# Altium schematic sheet Modulo_Sensores.SchDoc
size A4; PageSetup: Record=PageOptions|CenterHorizontal=True|CenterVertical=True|PrintScale=1.00|XCorrection=1.00|YCorrection=1.00|PrintKind=1|BorderSize=5000000|LeftOffset=0|BottomOffset=0|Orientation=2|PaperLength=1000|PaperWidth=1000|Scale=100|PaperSource=7|PrintQuality=-4|MediaType=1|DitherType=10|PaperKind=A4 (210 x 297 mm)|PrintScaleMode=1
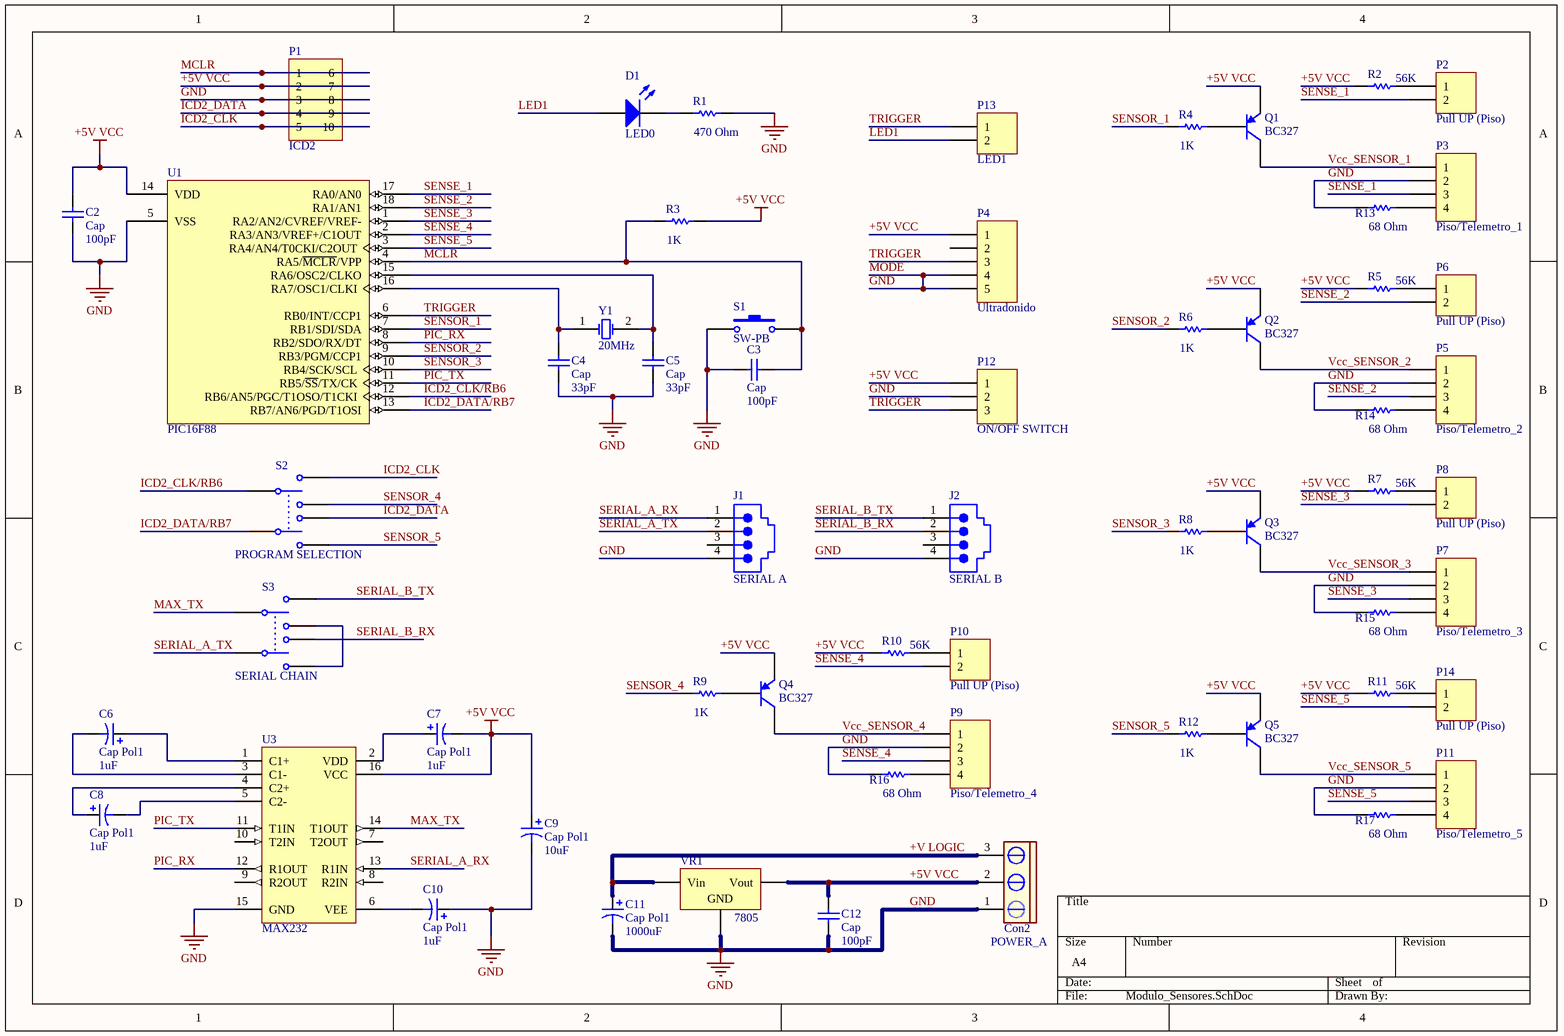
[diagram p0: Modulo_Sensores.SchDoc]

## Parts
C2  Cap  value 100pF  [CAPR2.54-5.1x3.2]
C3  Cap  value 100pF  [CAPR2.54-5.1x3.2]
C4  Cap  value 33pF  [CAPR2.54-5.1x3.2]
C5  Cap  value 33pF  [CAPR2.54-5.1x3.2]
C6  Cap Pol1  value 1uF  [CAPPR2-5x6.8]
C7  Cap Pol1  value 1uF  [CAPPR2-5x6.8]
C8  Cap Pol1  value 1uF  [CAPPR2-5x6.8]
C9  Cap Pol1  value 10uF  [CAPPR2-5x6.8]
C10  Cap Pol1  value 1uF  [CAPPR2-5x6.8]
C11  Cap Pol1  value 1000uF  [RB5-10.5]
C12  Cap  value 100pF  [CAPR2.54-5.1x3.2]
Con2  POWER_A  [My_CN3]
D1  LED0  [LED-0]
J1  SERIAL A  [15-43-6245]
J2  SERIAL B  [15-43-6245]
P1  ICD2  [HEADER10_5x2_B]
P2  Pull UP (Piso)  [HDR1X2]
P3  Piso/Telemetro_1  [HDR1X4]
P4  Ultradonido  [HDR1X5]
P5  Piso/Telemetro_2  [HDR1X4]
P6  Pull UP (Piso)  [HDR1X2]
P7  Piso/Telemetro_3  [HDR1X4]
P8  Pull UP (Piso)  [HDR1X2]
P9  Piso/Telemetro_4  [HDR1X4]
P10  Pull UP (Piso)  [HDR1X2]
P11  Piso/Telemetro_5  [HDR1X4]
P12  ON/OFF SWITCH  [HDR1X3]
P13  LED1  [HDR1X2]
P14  Pull UP (Piso)  [HDR1X2]
Q1  BC327  [TO-92A]
Q2  BC327  [TO-92A]
Q3  BC327  [TO-92A]
Q4  BC327  [TO-92A]
Q5  BC327  [TO-92A]
R1  value 470 Ohm  [AXIAL-0.3]  (hidden comment: Res1)
R2  value 56K  [AXIAL-0.3]  (hidden comment: Res1)
R3  value 1K  [AXIAL-0.3]  (hidden comment: Res1)
R4  value 1K  [AXIAL-0.3]  (hidden comment: Res1)
R5  value 56K  [AXIAL-0.3]  (hidden comment: Res1)
R6  value 1K  [AXIAL-0.3]  (hidden comment: Res1)
R7  value 56K  [AXIAL-0.3]  (hidden comment: Res1)
R8  value 1K  [AXIAL-0.3]  (hidden comment: Res1)
R9  value 1K  [AXIAL-0.3]  (hidden comment: Res1)
R10  value 56K  [AXIAL-0.3]  (hidden comment: Res1)
R11  value 56K  [AXIAL-0.3]  (hidden comment: Res1)
R12  value 1K  [AXIAL-0.3]  (hidden comment: Res1)
R13  value 68 Ohm  [AXIAL-0.3]  (hidden comment: Res1)
R14  value 68 Ohm  [AXIAL-0.3]  (hidden comment: Res1)
R15  value 68 Ohm  [AXIAL-0.3]  (hidden comment: Res1)
R16  value 68 Ohm  [AXIAL-0.3]  (hidden comment: Res1)
R17  value 68 Ohm  [AXIAL-0.3]  (hidden comment: Res1)
S1  SW-PB  [TS-063]
S2  PROGRAM SELECTION  [LD-202mini]
S3  SERIAL CHAIN  [LD-202mini]
U1  PIC16F88  [PDIP300-P18]
U3  MAX232  [PE16A]
VR1  7805  [My_TO-220]
Y1  20MHz  [My_Crystal]

## Nets
+5V VCC: C2.2 C7.2 C9.1 C12.2 Con2.2 P1.2 P1.7 P4.1 P12.1 Q1.1(E) Q2.1(E) Q3.1(E) Q4.1(E) Q5.1(E) R2.1 R3.2 R5.1 R7.1 R10.1 R11.1 U1.14(VDD) U3.16(VCC) VR1.3(Vout)
GND: C2.1 C3.1 C4.1 C5.1 C9.2 C10.1 C11.2 C12.1 Con2.1 J1.4 J2.4 P1.3 P1.8 P3.2 P4.4 P4.5 P5.2 P7.2 P9.2 P11.2 P12.2 R1.2 R13.1 R14.1 R15.1 R16.1 R17.1 S1.1 U1.5(VSS) U3.15(GND) VR1.2(GND)  [also labelled MODE]
+V LOGIC: C11.1 Con2.3 VR1.1(Vin)
ICD2_CLK: P1.5 P1.10 S2.2
ICD2_CLK/RB6: S2.1 U1.12(RB6/AN5/PGC/T1OSO/T1CKI)
ICD2_DATA: P1.4 P1.9 S2.5
ICD2_DATA/RB7: S2.4 U1.13(RB7/AN6/PGD/T1OSI)
LED1: D1.1(A) P13.2
MAX_TX: S3.1 U3.14(T1OUT)
MCLR: C3.2 P1.1 P1.6 R3.1 S1.2 U1.4(RA5/~{MCLR}/VPP)
PIC_RX: U1.8(RB2/SDO/RX/DT) U3.12(R1OUT)
PIC_TX: U1.11(RB5/~{SS}/TX/CK) U3.11(T1IN)
SENSE_1: P2.2 P3.3 U1.17(RA0/AN0)
SENSE_2: P5.3 P6.2 U1.18(RA1/AN1)
SENSE_3: P7.3 P8.2 U1.1(RA2/AN2/CVREF/VREF-)
SENSE_4: P9.3 P10.2 U1.2(RA3/AN3/VREF+/C1OUT)
SENSE_5: P11.3 P14.2 U1.3(RA4/AN4/T0CKI/C2OUT)
SENSOR_1: R4.1 U1.7(RB1/SDI/SDA)
SENSOR_2: R6.1 U1.9(RB3/PGM/CCP1)
SENSOR_3: R8.1 U1.10(RB4/SCK/SCL)
SENSOR_4: R9.1 S2.3
SENSOR_5: R12.1 S2.6
SERIAL_A_RX: J1.1 U3.13(R1IN)
SERIAL_A_TX: J1.2 S3.4
SERIAL_B_RX: J2.2 S3.5
SERIAL_B_TX: J2.1 S3.2
TRIGGER: P4.3 P12.3 P13.1 U1.6(RB0/INT/CCP1)
Vcc_SENSOR_1: P3.1 Q1.3(C)
Vcc_SENSOR_2: P5.1 Q2.3(C)
Vcc_SENSOR_3: P7.1 Q3.3(C)
Vcc_SENSOR_4: P9.1 Q4.3(C)
Vcc_SENSOR_5: P11.1 Q5.3(C)
NetC4_2: C4.2 U1.16(RA7/OSC1/CLKI) Y1.1(OSC1)
NetC5_2: C5.2 U1.15(RA6/OSC2/CLKO) Y1.2(OSC2)
NetC6_1: C6.1 U3.1(C1+)
NetC6_2: C6.2 U3.3(C1-)
NetC7_1: C7.1 U3.2(VDD)
NetC8_1: C8.1 U3.4(C2+)
NetC8_2: C8.2 U3.5(C2-)
NetC10_2: C10.2 U3.6(VEE)
NetD1_2: D1.2(K) R1.1
NetP2_1: P2.1 R2.2
NetP3_4: P3.4 R13.2
NetP5_4: P5.4 R14.2
NetP6_1: P6.1 R5.2
NetP7_4: P7.4 R15.2
NetP8_1: P8.1 R7.2
NetP9_4: P9.4 R16.2
NetP10_1: P10.1 R10.2
NetP11_4: P11.4 R17.2
NetP14_1: P14.1 R11.2
NetQ1_2: Q1.2(B) R4.2
NetQ2_2: Q2.2(B) R6.2
NetQ3_2: Q3.2(B) R8.2
NetQ4_2: Q4.2(B) R9.2
NetQ5_2: Q5.2(B) R12.2
NetS3_3: S3.3 S3.6

Not connected (* = marked no-connect by the designer): J1 3; J2 3; P4 2; U3 7(T2OUT) 8(R2IN) 9(R2OUT) 10(T2IN)

## Library data of the parts
C2-C5 C12 = Cap: Capacitor; Published: 8-Jun-2000; LatestRevisionDate: 17-Jul-2002; LatestRevisionNote: Re-released for DXP Platform.; PackageReference: RAD-0.3; Publisher: Altium Limited
C6-C11 = Cap Pol1: Polarized Capacitor (Radial); Published: 8-Jun-2000; LatestRevisionDate: 17-Jul-2002; LatestRevisionNote: Re-released for DXP Platform.; PackageReference: RB7.6-15; Publisher: Altium Limited
Con2 = CON3 pin Green: Connector green screw
D1 = LED0: Typical INFRARED GaAs LED; Published: 8-Jun-2000; LatestRevisionDate: 08-Jul-2005; LatestRevisionNote: Mech Layer 1 removed.; PackageReference: LED-0; Publisher: Altium Limited
J1 J2 = 15-43-6245: Right Angle, Standard Profile, RJ45-Keyed, Flange Mount PCB Jack; Ports: 1; Positions/Loaded: Port1 - 8 Keyed/4; PerformanceCategory: 3; PCB_Mounting: Thru-Hole; ComponentAvailability: Obsolete; DrillSize: Nominal, Rounded to nearest 0.05mm; PCB_Layout: Complies with Manufacturer's Recommendation.; Published: 25-Jun-2002; DatasheetDocument: 18-Dec-2001; PackageDocument: 18-Dec-2001; PackageReference: 15-43-6245; Publisher: Altium Limited; ComponentLink1Description: Manufacturer Link; ComponentLink1URL: http://www.molex.com/; ComponentLink2Description: Datasheet; ComponentLink2URL: http://www.molex.com/cmc_upload/common_files/1212003_catalogmx41314.pdf; ComponentLink3Description: Iges Model; ComponentLink3URL: http://www.molex.com/pdm_docs/igs/15-43-6233_igs.zip
P1 = Header 5X2A: Header, 5-Pin, Dual row; LatestRevisionDate: 17-Jul-2002; LatestRevisionNote: Re-released for DXP Platform.; Publisher: Altium Limited
P2 P6 P8 P10 P13 P14 = Header 2: Header, 2-Pin; LatestRevisionDate: 17-Jul-2002; LatestRevisionNote: Re-released for DXP Platform.; Publisher: Altium Limited
P3 P5 P7 P9 P11 = Header 4: Header, 4-Pin; LatestRevisionDate: 17-Jul-2002; LatestRevisionNote: Re-released for DXP Platform.; Publisher: Altium Limited
P4 = Header 5: Header, 5-Pin; LatestRevisionDate: 17-Jul-2002; LatestRevisionNote: Re-released for DXP Platform.; Publisher: Altium Limited
P12 = Header 3: Header, 3-Pin; LatestRevisionDate: 17-Jul-2002; LatestRevisionNote: Re-released for DXP Platform.; Publisher: Altium Limited
Q1-Q5 = 2N5771: PNP Switching Transistor; Published: 8-Jun-2000; LatestRevisionDate: 17-Jan-2003; LatestRevisionNote: PCB Footprint 'BCY-W3/D4.7' replaced; DatasheetDocument: 1997; PackageDocument: Sep-1998; PackageReference: TO-92A; Publisher: Altium Limited; ComponentLink1Description: Manufacturer Link; ComponentLink1URL: http://www.fairchildsemi.com/; ComponentLink2Description: Datasheet; ComponentLink2URL: http://www.fairchildsemi.com/ds/2N%2F2N5771.pdf
R1-R17 = Res1: Resistor; Published: 8-Jun-2000; LatestRevisionDate: 17-Jul-2002; LatestRevisionNote: Re-released for DXP Platform.; PackageReference: AXIAL-0.3; Publisher: Altium Limited
S1 = SW-PB: Switch; Published: 24-Mar-1999; LatestRevisionDate: 17-Jul-2002; LatestRevisionNote: Re-released for DXP Platform.; PackageReference: SPST-2; Publisher: Altium Limited
S2 S3 = SW-DPDT: Double-Pole, Double-Throw Switch; Published: 24-Mar-1999; LatestRevisionDate: 17-Jul-2002; LatestRevisionNote: Re-released for DXP Platform.; PackageReference: DPDT-6; Publisher: Altium Limited
U1 = PIC16F88-E/P: Enhanced FLASH Microcontroller with nanoWatt Technology, 10-Bit A/D, 4K (x14-Bit words) FLASH, 368 Bytes RAM, 18-Pin PDIP, Standard VDD Range, Extended Temperature; Note: The CCP1 pin is determined by CCPMX in Configuration Word 1 register.; Published: 11-Oct-2004; LatestRevisionDate: 29-Jan-2009; LatestRevisionNote: Sch. layout revised. 3D Model Removed.; DatasheetVersion: revC, Jan-2005; PackageVersion: revAW, Oct-2008; PackageReference: PDIP300-P18; Publisher: Altium Limited; PackageDescription: 18-Lead Plastic Dual In-Line (P) - 300 mil Body [PDIP]; Code_JEDEC: MS-001; ComponentLink1Description: Manufacturer Link; ComponentLink1URL: http://www.microchip.com; ComponentLink2Description: Datasheet; ComponentLink2URL: http://ww1.microchip.com/downloads/en/DeviceDoc/30487b.pdf; ComponentLink3Description: Packaging Specification; ComponentLink3URL: http://ww1.microchip.com/downloads/en/PackagingSpec/00049AW.pdf
U3 = MAX232ACPE: +5V Powered, Multi-Channel RS-232 Driver/Receiver; Published: 16-Jan-2001; LatestRevisionDate: 29-May-2009; LatestRevisionNote: Component Body Added.; PackageVersion: 1997; PackageReference: PE16A; Publisher: Altium Limited; PackageDescription: DIP, 16-Pin, Row Spacing 7.62 mm, Pitch 2.54 mm; Code_JEDEC: MS-001-BB; ComponentLink1Description: Manufacturer Link; ComponentLink1URL: http://www.maxim-ic.com/; ComponentLink2Description: Datasheet; ComponentLink2URL: http://pdfserv.maxim-ic.com/en/ds/MAX220-MAX249.pdf
VR1 = Volt Reg: Voltage Regulator; Published: 24-Mar-1999; LatestRevisionDate: 29-May-2009; LatestRevisionNote: IPC-7351 Footprint Added.; PackageReference: D2PAK; Publisher: Altium Limited; PackageDescription: 3-Pin Transistor Outline Package 2.54 mm Pitch, 15.1 mm Lead Span
Y1 = XTAL: Crystal Oscillator; Published: 8-Jun-2000; LatestRevisionDate: 17-Jul-2002; LatestRevisionNote: Re-released for DXP Platform.; PackageReference: R38; Publisher: Altium Limited